# Altium project TAUV-Regulated_Power.PrjPcb (part 2 of 2)
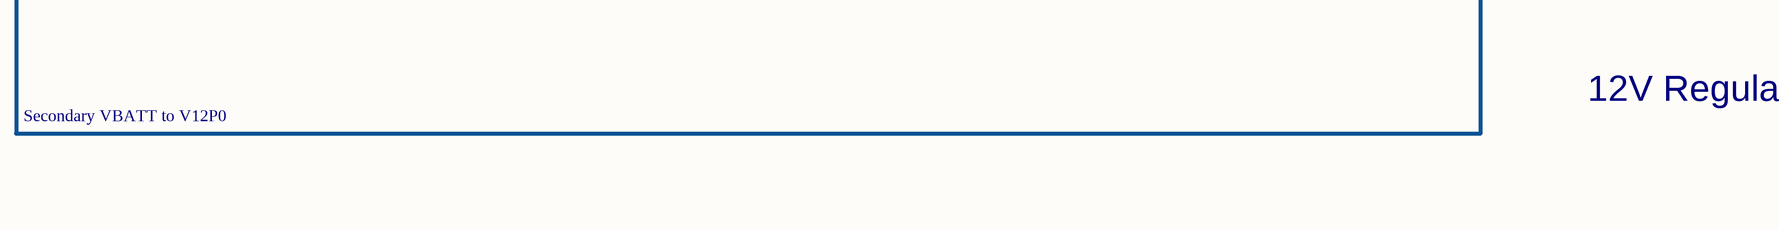
[diagram p8: Sht3-V12P0_reg.SchDoc, bottom right]

## Nets that join several sheets
GND: Sht4-Interfaces (67 pins), Sht2-Regulators (39 pins), Sht3-V12P0_reg (120 pins)
V3P3: Sht4-Interfaces (11 pins), Sht2-Regulators (8 pins)
V5P0: Sht4-Interfaces (12 pins), Sht2-Regulators (8 pins)
V5P0_12V_EN: Sht4-Interfaces (R36.2), Sht3-V12P0_reg (5 pins)
V5P0_Servo: Sht4-Interfaces (P2.5 R10.1 R13.2 TP10.1), Sht2-Regulators (11 pins)
V12P0: Sht4-Interfaces (10 pins), Sht3-V12P0_reg (41 pins)
VCC_BATT_FILT: Sht4-Interfaces (12 pins), Sht2-Regulators (13 pins), Sht3-V12P0_reg (28 pins)